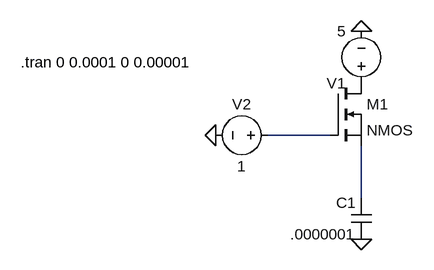
[diagram p0: schematic Mosfet_Ram_cell.asc]
Mosfet_Ram_cell.asc, the LTspice schematic file:
Version 4
SHEET 1 880 680
WIRE 192 192 96 192
WIRE 240 288 240 208
FLAG 16 192 0
FLAG 240 32 0
FLAG 240 352 0
SYMBOL nmos 192 112 R0
SYMATTR InstName M1
SYMBOL voltage 240 128 R180
WINDOW 123 0 0 Left 2
WINDOW 39 0 0 Left 2
SYMATTR InstName V1
SYMATTR Value 5
SYMBOL voltage 112 192 R90
WINDOW 0 -32 56 VBottom 2
WINDOW 3 32 56 VTop 2
WINDOW 123 0 0 Left 2
WINDOW 39 0 0 Left 2
SYMATTR InstName V2
SYMATTR Value 1
SYMBOL cap 256 352 R180
WINDOW 0 24 56 Left 2
WINDOW 3 24 8 Left 2
SYMATTR InstName C1
SYMATTR Value .0000001
TEXT -284 80 Left 2 !.tran 0 0.0001 0 0.00001

The netlist it stands for:
* Mosfet_Ram_cell.asc
M1 P001 N001 N002 N002 NMOS
V1 P001 0 5
V2 N001 0 1
C1 0 N002 .0000001
.model NMOS NMOS
.model PMOS PMOS
.lib standard.mos
.tran 0 0.0001 0 0.00001
.backanno
.end